# Altium schematic sheet CoverPage.SchDoc
size 420 x 297 mm; SheetNumber: 1; SheetTotal: 4
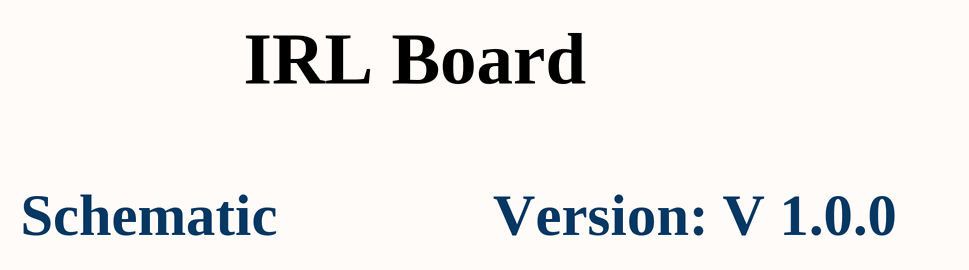
[diagram p0: CoverPage.SchDoc]

## Notes on the sheet
- IRL Board
- Schematic
- Version:
- V 1.0.0
- Project
- Sub-system:
- Design by:
- Sheet title:
- Sheet:
- of
- Checked by:
- Approved by:
- Doc no:
- Revision
- Size:
- Date: